# Altium project FMC_SFP_ADAPTER.PrjPcb
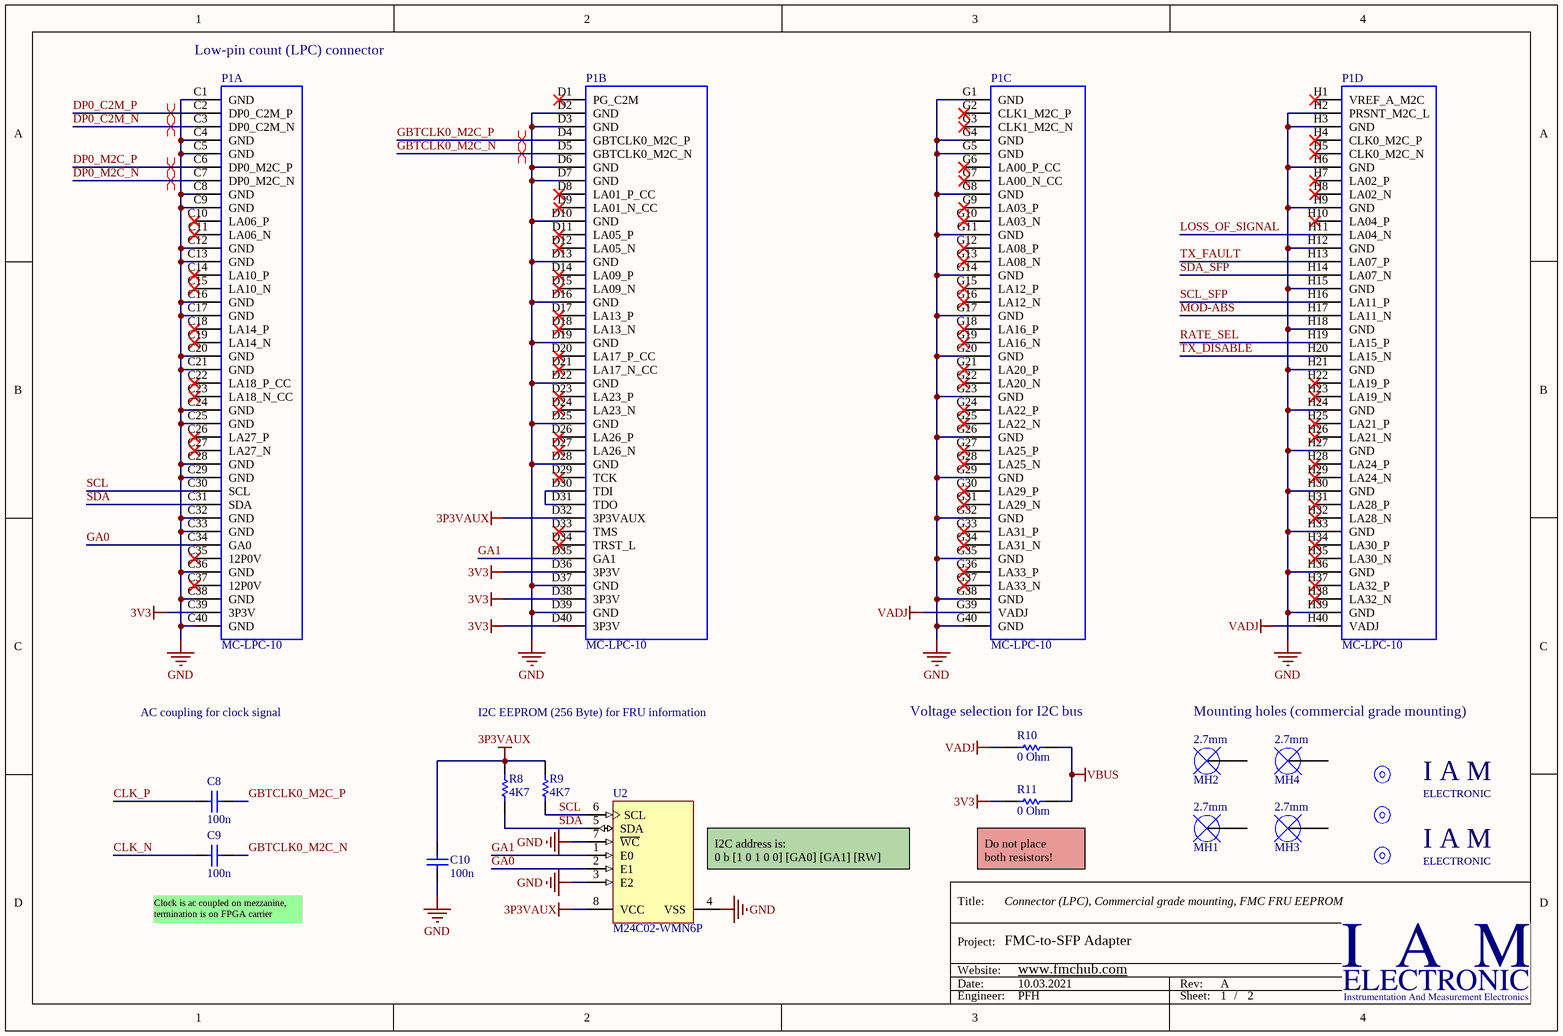
[diagram p0: FMC_SFP_ADAPTER_FMC.SchDoc]
2 sheets, 40 parts. Net scope: global (net labels, ports and power ports of the same name join across sheets).
Board file: FMC_SFP_ADAPTER.PcbDoc
Sheets:
  FMC_SFP_ADAPTER_FMC.SchDoc
  FMC_SFP_ADAPTER_SFP.SchDoc

## Sheet FMC_SFP_ADAPTER_FMC.SchDoc: Connector (LPC), Commercial grade mounting, FMC FRU EEPROM
size A4; Date: 10.03.2021; DrawnBy: PFH; Engineer: PFH; DocumentNumber: 1; Revision: A; SheetNumber: 1; SheetTotal: 2; Projekt: FMC-to-SFP Adapter; Website: www.fmchub.com; ProjectName: FMC_Single_LPC_Commercial

### Parts
C8  100n  [CAPC1005X55X25ML05T10]
C9  100n  [CAPC1005X55X25ML05T10]
C10  100n  [CAPC1005X55X25ML05T10]
FM1  1mm  [FIDUCIAL_MARK_ROUND_RING]  (value not drawn)  (no BOM)
FM2  1mm  [FIDUCIAL_MARK_ROUND_RING]  (value not drawn)  (no BOM)
FM3  1mm  [FIDUCIAL_MARK_ROUND_RING]  (value not drawn)  (no BOM)
MH1  2.7mm  [Mounting_Hole_Plated_2.7mm - d3.1mm]  (no BOM)
MH2  2.7mm  [Mounting_Hole_Plated_2.7mm - d3.1mm]  (no BOM)
MH3  2.7mm  [Mounting_Hole_Plated_2.7mm-COVERED]  (no BOM)
MH4  2.7mm  [Mounting_Hole_Plated_2.7mm-COVERED]  (no BOM)
P1  MC-LPC-10  [ASP-134604-01]  (parts A,B,C,D of 4)
R8  4K7  [RESC1005X40X25ML05T05]
R9  4K7  [RESC1005X40X25ML05T05]
R10  0 Ohm  [RESC3116X65X40LL10T20]
R11  0 Ohm  [RESC3116X65X40LL10T20]  (no BOM)
STR1  IAM LOGO  [IAM LOGO - LARGE - WWW]  (value not drawn)  (no BOM)
STR2  IAM LOGO  [IAM LOGO - LARGE - WWW]  (value not drawn)  (no BOM)
U2  M24C02-WMN6P  [STM-SO-8_D_L]

### Nets
3P3VAUX: C10.2 P1.D32(3P3VAUX) R8.2 R9.2 U2.8(VCC)
3V3: P1.C39(3P3V) P1.D36(3P3V) P1.D38(3P3V) P1.D40(3P3V) R11.1
GND: C10.1 P1.C1(GND) P1.C4(GND) P1.C5(GND) P1.C8(GND) P1.C9(GND) P1.C12(GND) P1.C13(GND) P1.C16(GND) P1.C17(GND) P1.C20(GND) P1.C21(GND) P1.C24(GND) P1.C25(GND) P1.C28(GND) P1.C29(GND) P1.C32(GND) P1.C33(GND) P1.C36(GND) P1.C38(GND) P1.C40(GND) P1.D2(GND) P1.D3(GND) P1.D6(GND) P1.D7(GND) P1.D10(GND) P1.D13(GND) P1.D16(GND) P1.D19(GND) P1.D22(GND) P1.D25(GND) P1.D28(GND) P1.D37(GND) P1.D39(GND) P1.G1(GND) P1.G4(GND) P1.G5(GND) P1.G8(GND) P1.G11(GND) P1.G14(GND) P1.G17(GND) P1.G20(GND) P1.G23(GND) P1.G26(GND) P1.G29(GND) P1.G32(GND) P1.G35(GND) P1.G38(GND) P1.G40(GND) P1.H2(PRSNT_M2C_L) P1.H3(GND) P1.H6(GND) P1.H9(GND) P1.H12(GND) P1.H15(GND) P1.H18(GND) P1.H21(GND) P1.H24(GND) P1.H27(GND) P1.H30(GND) P1.H33(GND) P1.H36(GND) P1.H39(GND) U2.3(E2) U2.4(VSS) U2.7(~{WC})
VADJ: P1.G39(VADJ) P1.H40(VADJ) R10.1
VBUS: R10.2 R11.2
CLK_N: C9.2
CLK_P: C8.2
DP0_C2M_N: P1.C3(DP0_C2M_N)
DP0_C2M_P: P1.C2(DP0_C2M_P)
DP0_M2C_N: P1.C7(DP0_M2C_N)
DP0_M2C_P: P1.C6(DP0_M2C_P)
GA0: P1.C34(GA0) U2.2(E1)
GA1: P1.D35(GA1) U2.1(E0)
GBTCLK0_M2C_N: C9.1 P1.D5(GBTCLK0_M2C_N)
GBTCLK0_M2C_P: C8.1 P1.D4(GBTCLK0_M2C_P)
LOSS_OF_SIGNAL: P1.H11(LA04_N)
MOD-ABS: P1.H17(LA11_N)
RATE_SEL: P1.H19(LA15_P)
SCL: P1.C30(SCL) R9.1 U2.6(SCL)
SCL_SFP: P1.H16(LA11_P)
SDA: P1.C31(SDA) R8.1 U2.5(SDA)
SDA_SFP: P1.H14(LA07_N)
TX_DISABLE: P1.H20(LA15_N)
TX_FAULT: P1.H13(LA07_P)
NetP1_D30: P1.D30(TDI) P1.D31(TDO)

Not connected (* = marked no-connect by the designer): FM1 FD0; FM2 FD0; FM3 FD0; MH1 0; MH2 0; MH3 0; MH4 0; P1 C10(LA06_P)* C11(LA06_N)* C14(LA10_P)* C15(LA10_N)* C18(LA14_P)* C19(LA14_N)* C22(LA18_P_CC)* C23(LA18_N_CC)* C26(LA27_P)* C27(LA27_N)* C35(12P0V)* C37(12P0V)* D1(PG_C2M)* D8(LA01_P_CC)* D9(LA01_N_CC)* D11(LA05_P)* D12(LA05_N)* D14(LA09_P)* D15(LA09_N)* D17(LA13_P)* D18(LA13_N)* D20(LA17_P_CC)* D21(LA17_N_CC)* D23(LA23_P)* D24(LA23_N)* D26(LA26_P)* D27(LA26_N)* D29(TCK)* D33(TMS)* D34(TRST_L)* G2(CLK1_M2C_P)* G3(CLK1_M2C_N)* G6(LA00_P_CC)* G7(LA00_N_CC)* G9(LA03_P)* G10(LA03_N)* G12(LA08_P)* G13(LA08_N)* G15(LA12_P)* G16(LA12_N)* G18(LA16_P)* G19(LA16_N)* G21(LA20_P)* G22(LA20_N)* G24(LA22_P)* G25(LA22_N)* G27(LA25_P)* G28(LA25_N)* G30(LA29_P)* G31(LA29_N)* G33(LA31_P)* G34(LA31_N)* G36(LA33_P)* G37(LA33_N)* H1(VREF_A_M2C)* H4(CLK0_M2C_P)* H5(CLK0_M2C_N)* H7(LA02_P)* H8(LA02_N)* H10(LA04_P)* H22(LA19_P)* H23(LA19_N)* H25(LA21_P)* H26(LA21_N)* H28(LA24_P)* H29(LA24_N)* H31(LA28_P)* H32(LA28_N)* H34(LA30_P)* H35(LA30_N)* H37(LA32_P)* H38(LA32_N)*

### Layout directives
differential pair: DP0_C2M_N, DP0_C2M_P, DP0_M2C_N, DP0_M2C_P, GBTCLK0_M2C_N, GBTCLK0_M2C_P

### Notes on the sheet
- (near P1) Low-pin count (LPC) connector
- AC coupling for clock signal
- I2C EEPROM (256 Byte) for FRU information
- (near R10) Voltage selection for I2C bus
- Mounting holes (commercial grade mounting)
- (near C9) Clock is ac coupled on mezzanine,
  termination is on FPGA carrier
- (near U2) I2C address is:
  0 b [1 0 1 0 0] [GA0] [GA1] [RW]
- (near R11) Do not place
  both resistors!
- Title:
- Project:
- Date:
- Website:
- Rev:
- Engineer:
- Sheet:
- /
- (in symbol IAM_LOGO) I A M; ELECTRONIC

### Library data of the parts
C8-C10 = CMP-2100-03641-1: Chip Capacitor, 0.1 uF, +/- 10%, 16 V, -55 to 125 degC, 0402 (1005 Metric), RoHS, Tape and Reel; Manufacturer: Murata; Part: GRM155R71C104KA88D; Material: Ceramic; Insulation Resistance: 10GR; Voltage: 16V; Dielectric: X7R; Capacitance: 100nF; REACH SVHC: NoSVHC; Depth: 0.5mm; Case/Package: 0402; Datasheet URL: http://psearch.en.murata.com/capacitor/product/GRM155R71C104KA88%23.pdf; Lead Free: LeadFree; Dielectric Material: Ceramic; Manufacturer URL: http://www.murata.com/; Min Operating Temperature: -55degC; Length: 1mm; Case Code (Metric): 1005; Radiation Hardening: No; Package Reference: 0402; RoHSCompliant: true; Datasheet Version: 42675.0; Thickness: 0.022inch; Packaging: TapeandReel; Voltage Rating (DC): 16V; Tolerance: 10%; Max Operating Temperature: 125degC; Package Description: 2-Pin Surface Mount Device, Body 1 x 0.5 mm; Mount: SurfaceMount; Height: 0.5mm; Width: 0.5mm; Number of Pins: 2; Voltage Rating: 16V; Case Code (Imperial): 0402; Termination: SMD/SMT; Package Quantity: 1
FM1-FM3 = Fiducial_Mark: Fiducial mark, width 1mm, clearance 3mm; Width: 1 mm; Clearance: 3 mm
MH1-MH4 = Mounting_Hole_2.7mm: Mounting hole, hole size 2.7mm; Hole radius: 2.7 mm; Diameter (plated): *; Keep out (radius): *; Plated: *
P1 = MC-LPC-10: MC-LPC-10, FMC Low-pin count connector, lead free, 160 I/Os, male, 10 mm mated stack height; Manufacturer: Samtec; Manufacturer Ref: SEAM-40-03.5-S-10-2-A-K-TR-VITA57; Pitch: 1.27 mm; Mated Stack Height: 10 mm; Solder Type: Lead-Free; Number I/O: 160; PartName: ASP-134604-01; Part: ASP-134604-01; Vita PartNumber: MC-LPC-10; Pin Count: Low; Gender: male; Supplier 1: Digi-Key; Supplier Part Number 1: SAM8732-ND
R8 R9 = CMP-2002-00051-2: Chip Resistor, 4.7 KOhm, +/- 1%, 63 mW, -55 to 155 degC, 0402 (1005 Metric), RoHS, Tape and Reel; PartNumber: CRCW04024K70FKED; Manufacturer: Vishay; Power Rating: 63 mW; Voltage Rating: 50 V; Length: 1 mm; Mount: Surface Mount; Case Code (Metric): 1005; ComponentLink1Description: Datasheet; Package Quantity: 10000; Case Code (Imperial): 0402; Max Operating Temperature: 155 degC; Case/Package: 0402; REACH SVHC: Unknown; PackageDescription: 2-Pin Surface Mount Device, Body 1 x 0.5 mm; Width: 0.5 mm; Min Operating Temperature: -55 degC; Resistance: 4.7 KOhm; Height: 0.35 mm; Packaging: Tape and Reel; Mounting Technology: Surface Mount; Tolerance: 1%; RoHSCompliant: True; ComponentLink1URL: http://www.vishay.com/docs/20035/dcrcwe3.pdf; Part: CRCW04024K70FKED
R10 R11 = CMP-2100-03681-1: Chip Resistor, 0 Ohm, +/- 5%, -55 to 155 degC, 1206 (3216 Metric), RoHS, Tape and Reel; Manufacturer: Yageo; Part: RC1206JR-070RL; Max Power Dissipation: 250mW; Resistance: 0mOhm; Voltage Rating: 200V; Temperature Coefficient: 200ppm/degreesC; Case Code (Imperial): 1206; Lead Free: LeadFree; Package Quantity: 5000; Radiation Hardening: No; Tolerance: 5%; Length: 3.1mm; Termination: SMD/SMT; Contact Plating: Tin; Military Standard: Not; Manufacturer URL: http://www.yageo.com/; Datasheet URL: http://www.yageo.com/documents/recent/PYu-RC_Group_51_RoHS_L_5.pdf; Height: 0.026inch; RoHSCompliant: true; Min Operating Temperature: -55degC; REACH SVHC: Unknown; Max Operating Temperature: 155degC; Depth: 1.6mm; Packaging: TapeandReel; Package Reference: 1206.0; Number of Terminations: 2; Case/Package: 1206; Composition: CarbonFilm; Case Code (Metric): 3216; Datasheet Version: Rev. 5, 10/2016; Power Rating: 250mW; Package Description: 2-Pin Surface Mount Device, Body 3.1 x 1.6 mm; Width: 0.063inch
STR1 STR2 = IAM_LOGO: I A M E L E C T R O N I C - Logo; Layer: Top Overlay; Manufacturer: IAM ELECTRONIC; Part: Logo
U2 = CMP-2000-06638-1: 2-Kbit Serial I2C Bus EEPROM, 2.5 to 5.5 V, -40 to 85 degC, 8-Pin SOIC, RoHS, Tube; Manufacturer: STMicroelectronics; Programming Voltage: 2.5 / V; Interface Type: Serial-I2C; Number of Words: 256; Maximum Random Access Time: 100 / ns; Data Retention: <specialid="6"/>specialid="80"/>200 / yr; Number of Bits per Word: 8 / bit; Memory Size: 2 / kbit; Maximum Operating Supply Voltage: 5.5 / V; Organisation: 256x8; Operating Temperature Range: -40to+85 / °C; Dimensions: 5.000x4.000x1.500 / mm; Height: 1.5 / mm; Operating Supply Voltage Range: 2.5to5.5 / V; Package Type: SO; Manufacturer URL: http://www.st.com/; Package Reference: SO-8; Mounting Technology: SurfaceMount; Package Description: 8-Pin Small Outline Integrated Circuit, Body 4.9 x 3.9 mm, Pitch 1.27 mm; Maximum Operating Temperature: +85 / °C; Datasheet Version: Rev. 2, 09/2013; Minimum Operating Temperature: -40 / °C; Length: 5 / mm; Datasheet URL: http://www.st.com/content/ccc/resource/technical/document/datasheet/b0/d8/50/40/5a/85/49/6f/DM00071904.pdf/files/DM00071904.pdf/jcr:content/translations/en.DM00071904.pdf; Minimum Operating Supply Voltage: 2.5 / V; Mounting Type: SurfaceMount; Pin Count: 8; Width: 4 / mm; Part: M24C02-WMN6P

## Sheet FMC_SFP_ADAPTER_SFP.SchDoc: SFP Connector and case, power supply filtering and status flags, 125 MHz clock
size A4; Date: 10.03.2021; DrawnBy: PFH; Engineer: PFH; DocumentNumber: 1; Revision: A; SheetNumber: 2; SheetTotal: 2; Projekt: FMC-to-SFP Adapter; Website: www.fmchub.com; ProjectName: FMC_Single_LPC_Commercial
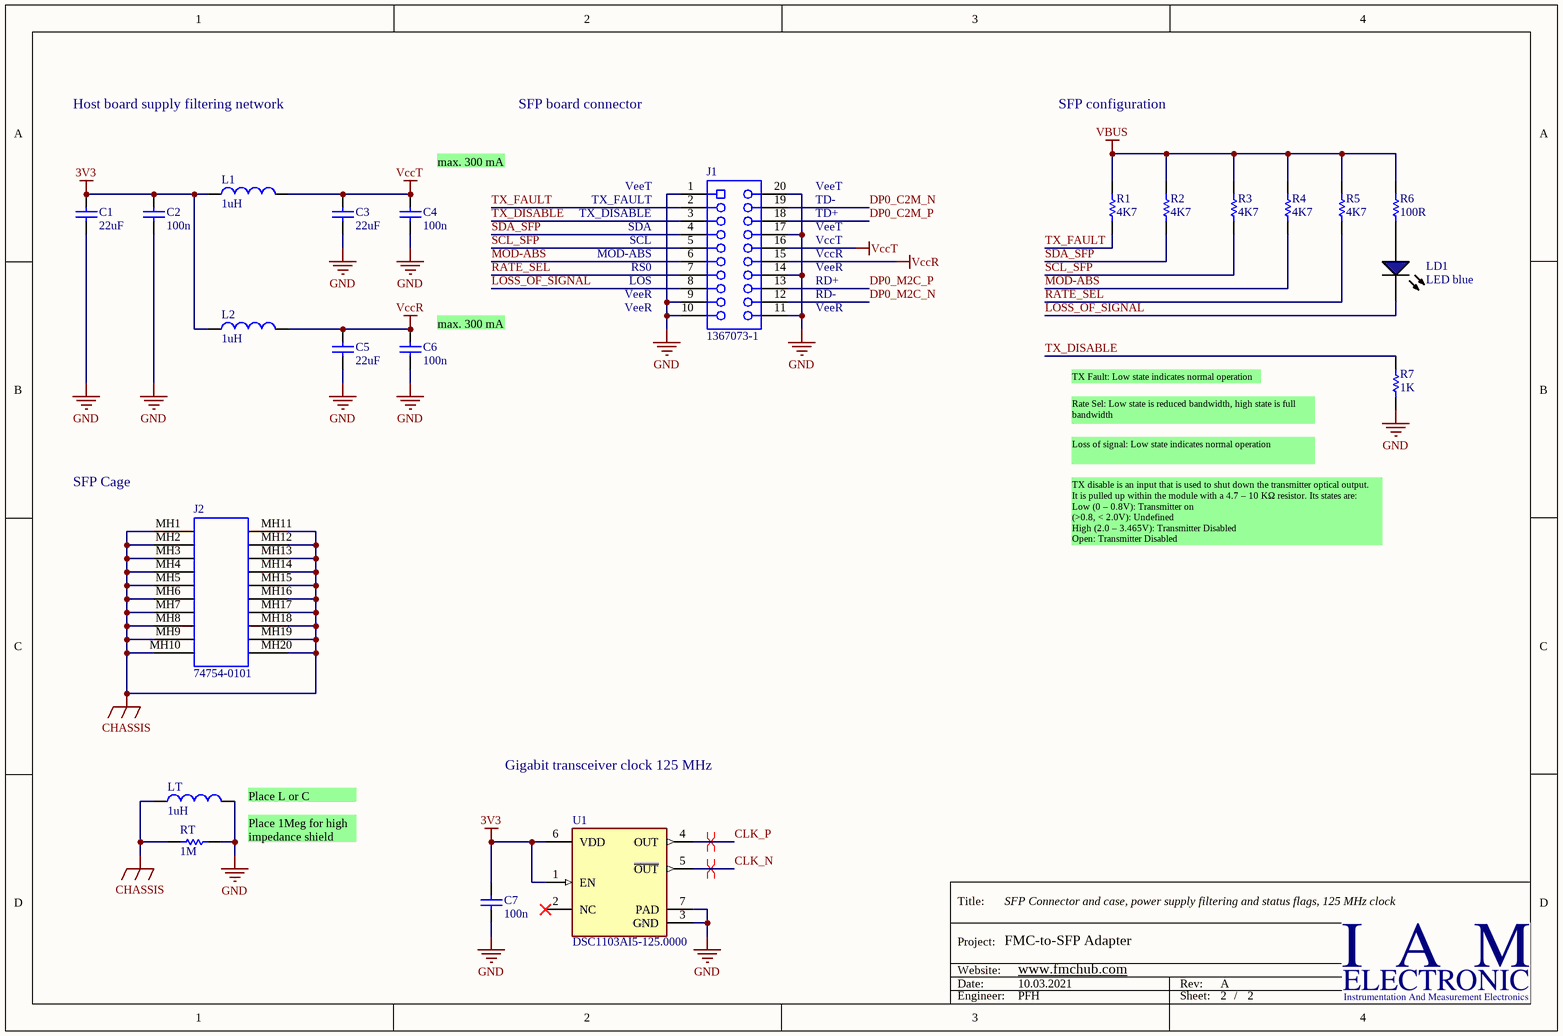
[diagram p1: FMC_SFP_ADAPTER_SFP.SchDoc]

### Parts
C1  22uF  [CAPC1206(3216)190_L]
C2  100n  [CAPC1005X55X25ML05T10]
C3  22uF  [CAPC1206(3216)190_L]
C4  100n  [CAPC1005X55X25ML05T10]
C5  22uF  [CAPC1206(3216)190_L]
C6  100n  [CAPC1005X55X25ML05T10]
C7  100n  [CAPC1005X55X25ML05T10]
J1  1367073-1  [TECO-1367073-1_V]
J2  74754-0101  [MOLX-74754-0101_V]
L1  1uH  [MURA-IND0805_H_0.55_L]
L2  1uH  [MURA-IND0805_H_0.55_L]
LD1  LED blue  [LED0603]
LT  1uH  [MURA-IND0805_H_0.55_L]
R1  4K7  [RESC1005X40X25ML05T05]
R2  4K7  [RESC1005X40X25ML05T05]
R3  4K7  [RESC1005X40X25ML05T05]
R4  4K7  [RESC1005X40X25ML05T05]
R5  4K7  [RESC1005X40X25ML05T05]
R6  100R  [RESC0603(1608)_N]
R7  1K  [RESC1608X55X25NL10T15]
RT  1M  [RESC0805(2012)_L]
U1  DSC1103AI5-125.0000  [FP-C04-1010-MFG]

### Nets
3V3: C1.2 C2.2 C7.1 L1.1 L2.1 U1.1(EN) U1.6(VDD)
CHASSIS: J2.MH1 J2.MH2 J2.MH3 J2.MH4 J2.MH5 J2.MH6 J2.MH7 J2.MH8 J2.MH9 J2.MH10 J2.MH11 J2.MH12 J2.MH13 J2.MH14 J2.MH15 J2.MH16 J2.MH17 J2.MH18 J2.MH19 J2.MH20 LT.1 RT.2
GND: C1.1 C2.1 C3.1 C4.1 C5.1 C6.1 C7.2 J1.1 J1.9 J1.10 J1.11 J1.14 J1.17 J1.20 LT.2 R7.1 RT.1 U1.3(GND) U1.7(PAD)
VBUS: R1.2 R2.2 R3.2 R4.2 R5.2 R6.2
VccR: C5.2 C6.2 J1.15 L2.2
VccT: C3.2 C4.2 J1.16 L1.2
CLK_N: U1.5(~{OUT})
CLK_P: U1.4(OUT)
DP0_C2M_N: J1.19
DP0_C2M_P: J1.18
DP0_M2C_N: J1.12
DP0_M2C_P: J1.13
LOSS_OF_SIGNAL: J1.8 LD1.2(K)
MOD-ABS: J1.6 R4.1
RATE_SEL: J1.7 R5.1
SCL_SFP: J1.5 R3.1
SDA_SFP: J1.4 R2.1
TX_DISABLE: J1.3 R7.2
TX_FAULT: J1.2 R1.1
NetLD1_1: LD1.1(A) R6.1

Not connected (* = marked no-connect by the designer): U1 2(NC)*

### Layout directives
differential pair: CLK_N, CLK_P

### Notes on the sheet
- Host board supply filtering network
- SFP board connector
- SFP configuration
- (near C4) max. 300 mA
- VeeT
- TX_FAULT
- TX_DISABLE
- SDA
- SCL
- TD-
- TD+
- VccT
- MOD-ABS
- RS0
- LOS
- VeeR
- VccR
- RD+
- RD-
- (near C6) max. 300 mA
- TX Fault: Low state indicates normal operation
- Rate Sel: Low state is reduced bandwidth, high state is full bandwidth
- SFP Cage
- Loss of signal: Low state indicates normal operation
- TX disable is an input that is used to shut down the transmitter optical output.
  It is pulled up within the module with a 4.7 – 10 KΩ resistor. Its states are:
  Low (0 – 0.8V): Transmitter on
  (>0.8, < 2.0V): Undefined
  High (2.0 – 3.465V): Transmitter Disabled
  Open: Transmitter Disabled
- Gigabit transceiver clock 125 MHz
- (near LT) Place L or C
- Place 1Meg for high impedance shield
- Title:
- Project:
- Date:
- Website:
- Rev:
- Engineer:
- Sheet:
- /

### Library data of the parts
C1 C3 C5 = CMP-1037-04985-1: CAP 22uF 6.3V X5R ±10% 1206 (3216 Metric) Thickness 1.9mm SMD; Part: JMK316ABJ226KL-T; Manufacturer: Taiyo Yuden; Case-EIA: 1206; Case-Metric: 3216; Tolerance: ±10%; Technology: SMT; Rated Voltage: 6.3V; Max Thickness: 1.9 mm; Value: 22uF
C2 C4 C6 C7 = CMP-2100-03641-1: as C8 on sheet FMC_SFP_ADAPTER_FMC; REACH SVHC: NoSVHC; Depth: 0.5mm; Case/Package: 0402; Datasheet URL: http://psearch.en.murata.com/capacitor/product/GRM155R71C104KA88%23.pdf; Lead Free: LeadFree; Dielectric Material: Ceramic; Manufacturer URL: http://www.murata.com/; Min Operating Temperature: -55degC; Length: 1mm; Case Code (Metric): 1005; Radiation Hardening: No; Package Reference: 0402; RoHSCompliant: true; Datasheet Version: 42675.0; Thickness: 0.022inch; Packaging: TapeandReel; Voltage Rating (DC): 16V; Tolerance: 10%; Max Operating Temperature: 125degC; Package Description: 2-Pin Surface Mount Device, Body 1 x 0.5 mm; Mount: SurfaceMount; Height: 0.5mm; Width: 0.5mm; Number of Pins: 2; Voltage Rating: 16V; Case Code (Imperial): 0402; Termination: SMD/SMT; Package Quantity: 1
J1 = CMP-2000-05488-1: Female Connector, Pitch 0.8 mm, 2 x 10 Position, Height 5.4 mm, -55 to 85 degC, RoHS, Tape and Reel; Manufacturer: TE Connectivity; Product Training Modules: HighSpeedPluggableI/OSolutions; 3D Model: 1367073-1.pdf; Connector Type: SFP; Other Names: A97430DKR; Mating Products: 516-2084-ND / -TXRXOPTICALSFF1.25GBDISCSI; Dynamic Catalog: SFPConnectors; Featured Product: HighSpeedPluggableI-OSolutions; Connector Style: Receptacle; Associated Product: A103997CT-ND / -CONNSFPCAGESINGLEW/OPIPE / A103997TR-ND / -CONNSFPCAGESINGLEW/OPIPE / 1367645-3-ND / -CONNCAGE&HEATSINKSGLPORTTIN / 1367645-2-ND / -CONNCAGE&HEATSINKSGLPORTTIN / 1888424-1-ND / -CONNCAGE1X2SFPENHANCEDEMI / 1367643-1-ND / -CONNCAGESNGLPORTDBLSIDETIN / 1489962-1-ND / -CONNSFPCAGESINGLEW/OPIPE / 1367645-1-ND / -CONNCAGE&HEATSINKSGLPORTTIN / A99375-ND / -CONNSFPCAGE1X4PIN-IN-PASTE / A97412CT-ND / -CONNSFPLOWERCAGEPCB / More...; Number of Positions: 20; Package Reference: 1367073-1; Package Description: Female Connector, Pitch 0.8 mm, 2 x 10 Position, Height 5.4 mm; RoHS Information: 1367073-1StatementofCompliance; Contact Finish: Gold; Datasheet URL: http://www.te.com/commerce/DocumentDelivery/DDEController?Action=showdoc&DocId=Customer+Drawing%7F1367073%7FK%7Fpdf%7FEnglish%7FENG_CD_1367073_K.pdf%7F1367073-1; Datasheet Version: Rev. K, 12/2012; Contact Finish Thickness: 15µin(0.38µm); Category: Connectors,Interconnects; Mounting Type: SurfaceMount,RightAngle; Mounting Technology: SurfaceMount; Packaging: Digi-Reel®; Manufacturer URL: http://www.te.com/; Family: PluggableConnectors; Standard Package: 1; Termination: Solder; Part: 1367073-1
J2 = CMP-1704-00003-3: SFP+ Cage, Single Port, Height 10.85 mm, Tail Height 3.05 mm, -40 to 85 degC, RoHS, Tray; Manufacturer: Molex; RoHSCompliant: True; ComponentLink3URL: http://www.molex.com/pdm_docs/sd/747540101_sd.pdf; Width: 49 mm; Height: 10.85 mm; Mounting Technology: Through Hole; ComponentLink2Description: Datasheet; ComponentLink3Description: Package Specification; DatasheetVersion: Rev. Jul-15; Package Quantity: 1152; PackageDescription: SFP+ Cage, Single Port, Height 10.85 mm, Tail Height 3.05 mm; Radiation Hardening: No; PackageVersion: Rev. J, 02/2015; ComponentLink1Description: Manufacturer URL; PartNumber: 74754-0101; ComponentLink1URL: http://www.molex.com/; Packaging: Tray; Length: 15.9 mm; ComponentLink2URL: http://www.molex.com/webdocs/datasheets/pdf/en-us/0747540101_IO_CONNECTORS.pdf; Part: 74754-0101
L1 L2 LT = CMP-2000-06589-1: Chip Inductor, 1.0 uH, +/- 20%, -55 to 125 degC, 2-Pin SMD (0805), RoHS, Tape and Reel; Manufacturer: Murata; Part: LQM21PN1R0MC0D; Rated Current-Max: 800mA; Inductance-Nom: 1H; DC Resistance: 0.19; Mounting Technology: SurfaceMount; Package Reference: 0805; Tolerance (%): 20%; Datasheet Version: 07/2014; Manufacturer URL: http://www.murata.com/; Package Description: 2-Pin Surface Mounted Device, Body 2 x 1.25 mm; Case Size/Dimension: 0805; Datasheet URL: https://datasheet.ciiva.com/3866/336lqm21pn1r0mc023-3866307.pdf
LD1 = LED_BLUE: LED blue, SMD 0603; Part: LTST-C190TBKT; Manufacturer: Lite-On; Voltage: 3.1 V; Color: blue
R1-R5 = CMP-2002-00051-2: as R8 on sheet FMC_SFP_ADAPTER_FMC; Length: 1 mm; Mount: Surface Mount; Case Code (Metric): 1005; ComponentLink1Description: Datasheet; Package Quantity: 10000; Case Code (Imperial): 0402; Max Operating Temperature: 155 degC; Case/Package: 0402; REACH SVHC: Unknown; PackageDescription: 2-Pin Surface Mount Device, Body 1 x 0.5 mm; Width: 0.5 mm; Min Operating Temperature: -55 degC; Resistance: 4.7 KOhm; Height: 0.35 mm; Packaging: Tape and Reel; Mounting Technology: Surface Mount; Tolerance: 1%; RoHSCompliant: True; ComponentLink1URL: http://www.vishay.com/docs/20035/dcrcwe3.pdf; Part: CRCW04024K70FKED
R6 = CMP-1012-00397-1: 100R 0.1W 1% 0603 (1608 Metric)  SMD; Part: RC0603FR-07100RL; Manufacturer: Yageo; Value: 100.00 Ohm; Case-EIA: 0603; Case-Metric: 1608; Technology: SMT; Tolerance: 1 %; Power: 0.1 W
R7 = CMP-1659-00009-4: Chip Resistor, 1 KOhm, +/-1%, 0.1 W, -55 to 155 degC, 0603 (1608 Metric), RoHS, Tape and Reel; Manufacturer: Yageo; Part: RC0603FR-071KL; Voltage Rating: 50 V; ComponentLink2URL: http://www.yageo.com/documents/recent/PYu-RC_Group_51_RoHS_L_04.pdf; Max Operating Temperature: 155 degC; PackageDescription: 2-Pin Surface Mount Device, Body 1.6 x 0.8 mm; Packaging: Tape and Reel; ComponentLink3Description: Package Specification; REACH SVHC: No SVHC; Mount: Surface Mount; ComponentLink2Description: Datasheet; Length: 1.6 mm; PackageReference: 0603; Height: 0.45 mm; DatasheetVersion: Rev. 4, 02/2016; Min Operating Temperature: -55 degC; ComponentLink1Description: Manufacturer URL; Package Quantity: 200; RoHSCompliant: true; ComponentLink3URL: http://www.farnell.com/datasheets/443971.pdf; Pins: 2; Mounting Technology: Surface Mount; ComponentLink1URL: http://www.yageo.com/
RT = CMP-1013-00146-1: Part: RC0805JR-071ML; Manufacturer: Yageo; Case-Metric: 2012; Tolerance: 5 %; Value: 1000000.00 Ohm; Power: 0.125 W; Case-EIA: 0805; Technology: SMT
U1 = CMP-06255-000001-1: MEMS OSC XO 125.0000MHZ LVDS SMD; Manufacturer: Microchip; Standoff Height: 0mm; Min Supply Voltage: 2.25V; Max Supply Voltage: 3.63V; Frequency: 125MHz; Max Supply Current: 32mA; Stability: 10ppm; Max Junction Temp: +150°C; Ipc Land Pattern Name: DFN700X500X85-6; ComponentLink2Description: Datasheet; Series: DSC1103; RoHS: TRUE; Temperature Range High: +105°C; Device Class L1: Passive Components; Automotive: No; Height: 0.9mm; Temperature Range Low: -40°C; ComponentLink2URL: http://ww1.microchip.com/downloads/en/DeviceDoc/DSC1103-23-Low-Jitter-Precision-LVDS-Oscillator-DS20005745B.pdf; Device Class L3: Oscillators; Ambient Temperature Range High: +105°C; Digikey Description: MEMS OSC XO 125.0000MHZ LVDS SMD; Lead Free: Yes; Device Class L2: Crystals / Oscillators; Octopart: https://octopart.com/dsc1103al1-100.0000-microchip-87209273; Category: Crys; Package: C04-1010; Ambient Temperature Range Low: -40°C; Manufacturer Part Number: DSC1103AI5-125.0000; Temperature: -40°C to +105°C; Part: DSC1103AI5-125.0000

## Nets that join several sheets
3V3: FMC_SFP_ADAPTER_FMC (5 pins), FMC_SFP_ADAPTER_SFP (7 pins)
GND: FMC_SFP_ADAPTER_FMC (66 pins), FMC_SFP_ADAPTER_SFP (19 pins)
VBUS: FMC_SFP_ADAPTER_FMC (R10.2 R11.2), FMC_SFP_ADAPTER_SFP (6 pins)
CLK_N: FMC_SFP_ADAPTER_FMC (C9.2), FMC_SFP_ADAPTER_SFP (U1.5)
CLK_P: FMC_SFP_ADAPTER_FMC (C8.2), FMC_SFP_ADAPTER_SFP (U1.4)
DP0_C2M_N: FMC_SFP_ADAPTER_FMC (P1.C3), FMC_SFP_ADAPTER_SFP (J1.19)
DP0_C2M_P: FMC_SFP_ADAPTER_FMC (P1.C2), FMC_SFP_ADAPTER_SFP (J1.18)
DP0_M2C_N: FMC_SFP_ADAPTER_FMC (P1.C7), FMC_SFP_ADAPTER_SFP (J1.12)
DP0_M2C_P: FMC_SFP_ADAPTER_FMC (P1.C6), FMC_SFP_ADAPTER_SFP (J1.13)
LOSS_OF_SIGNAL: FMC_SFP_ADAPTER_FMC (P1.H11), FMC_SFP_ADAPTER_SFP (J1.8 LD1.2)
MOD-ABS: FMC_SFP_ADAPTER_FMC (P1.H17), FMC_SFP_ADAPTER_SFP (J1.6 R4.1)
RATE_SEL: FMC_SFP_ADAPTER_FMC (P1.H19), FMC_SFP_ADAPTER_SFP (J1.7 R5.1)
SCL_SFP: FMC_SFP_ADAPTER_FMC (P1.H16), FMC_SFP_ADAPTER_SFP (J1.5 R3.1)
SDA_SFP: FMC_SFP_ADAPTER_FMC (P1.H14), FMC_SFP_ADAPTER_SFP (J1.4 R2.1)
TX_DISABLE: FMC_SFP_ADAPTER_FMC (P1.H20), FMC_SFP_ADAPTER_SFP (J1.3 R7.2)
TX_FAULT: FMC_SFP_ADAPTER_FMC (P1.H13), FMC_SFP_ADAPTER_SFP (J1.2 R1.1)